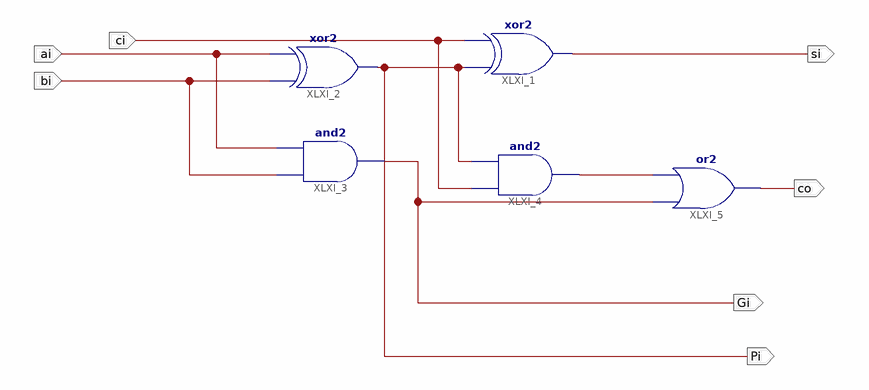
[diagram p0: schematic sheet 1]
// Xilinx ISE schematic add.sch (spartan3) as structural Verilog: 5 symbols, 7 ports
module add (
  input  ai,
  input  bi,
  input  ci,
  output si,
  output Pi,
  output Gi,
  output co
);

  wire XLXN_11;

  xor XLXI_1 (si, Pi, ci);
  xor XLXI_2 (Pi, bi, ai);
  and XLXI_3 (Gi, bi, ai);
  and XLXI_4 (XLXN_11, ci, Pi);
  or XLXI_5 (co, Gi, XLXN_11);
endmodule
